# Altium schematic sheet PCB_mini.SchDoc
size A4
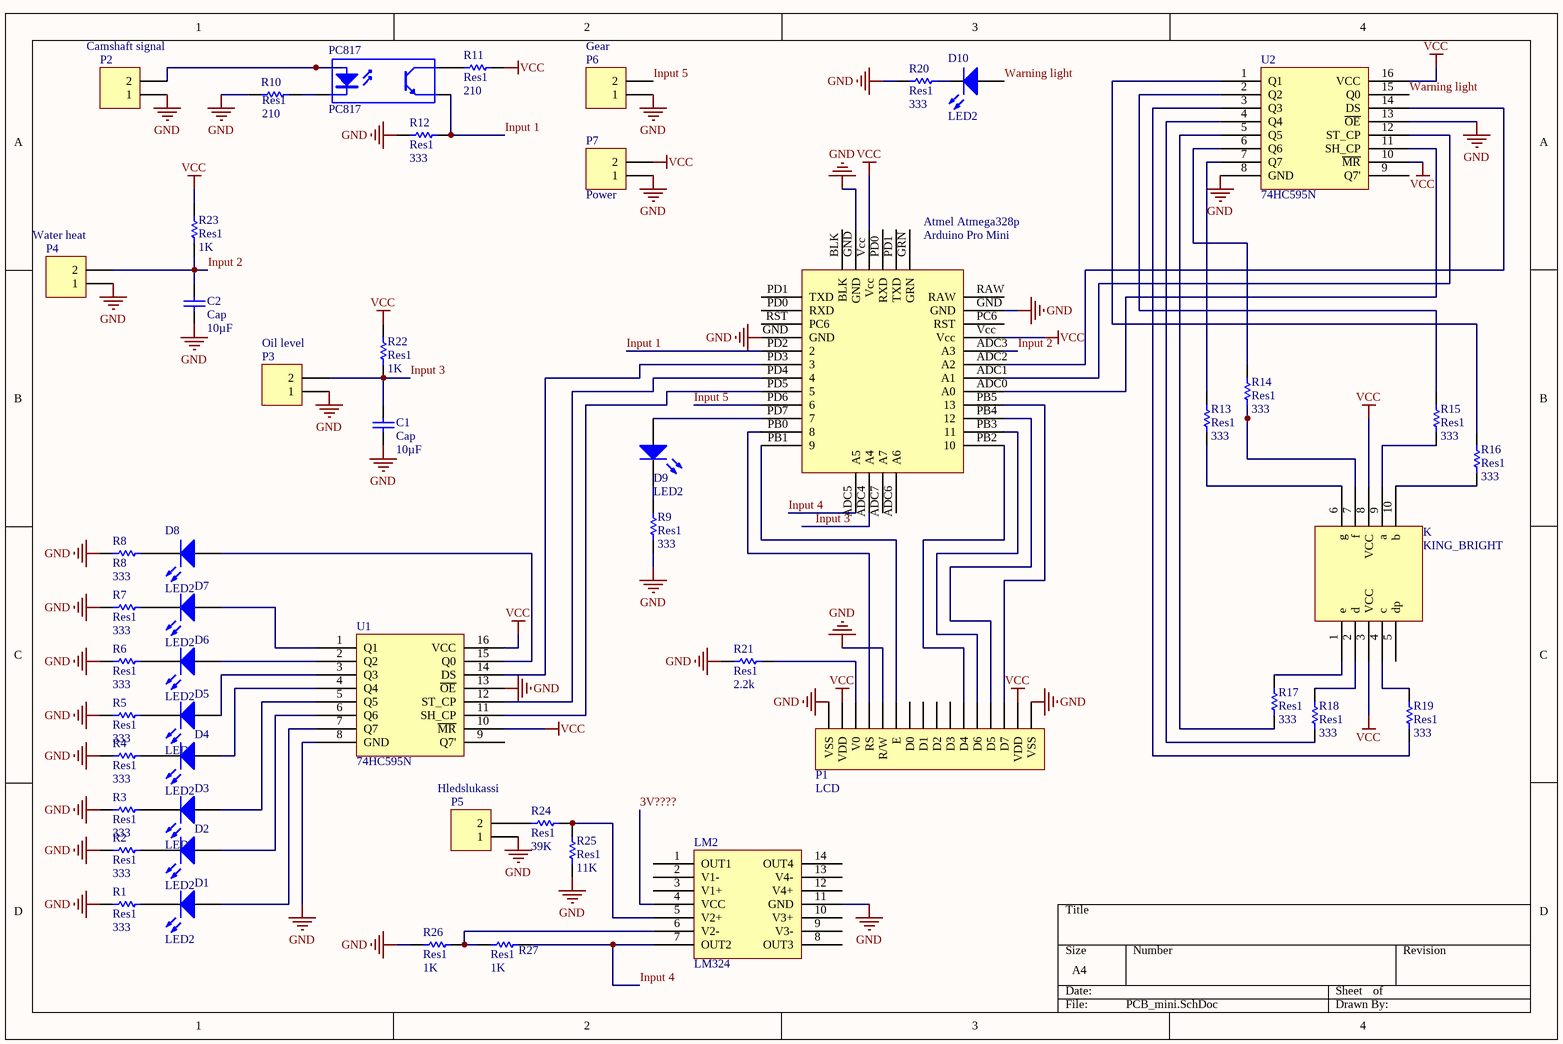
[diagram p0: PCB_mini.SchDoc]

## Parts
Arduino_Pro_Mini  Atmel Atmega328p  [ArduinoProMini]
C1  Cap  value 10µF  [1206 footprint]
C2  Cap  value 10µF  [1206 footprint]
D1  LED2  [3.2X1.6X1.1]
D2  LED2  [3.2X1.6X1.1]
D3  LED2  [3.2X1.6X1.1]
D4  LED2  [3.2X1.6X1.1]
D5  LED2  [3.2X1.6X1.1]
D6  LED2  [3.2X1.6X1.1]
D7  LED2  [3.2X1.6X1.1]
D8  LED2  [3.2X1.6X1.1]
D9  LED2  [3.2X1.6X1.1]
D10  LED2  [3.2X1.6X1.1]
K  KING_BRIGHT  [KNIGHT_BRIGHT]
LM2  LM324  [SOP-14]
P1  LCD  [HDR1X16]
P2  Camshaft signal  [HDR1X2]
P3  Oil level  [HDR1X2]
P4  Water heat  [HDR1X2]
P5  Hledslukassi  [HDR1X2]
P6  Gear  [HDR1X2]
P7  Power  [HDR1X2]
PC817  PC817  [PC817 SMT]
R1  Res1  value 333  [AXIAL-0.3]
R2  Res1  value 333  [AXIAL-0.3]
R3  Res1  value 333  [AXIAL-0.3]
R4  Res1  value 333  [AXIAL-0.3]
R5  Res1  value 333  [AXIAL-0.3]
R6  Res1  value 333  [AXIAL-0.3]
R7  Res1  value 333  [AXIAL-0.3]
R8  R8  value 333  [AXIAL-0.3]
R9  Res1  value 333  [AXIAL-0.3]
R10  Res1  value 210  [AXIAL-0.3]
R11  Res1  value 210  [AXIAL-0.3]
R12  Res1  value 333  [AXIAL-0.3]
R13  Res1  value 333  [AXIAL-0.3]
R14  Res1  value 333  [AXIAL-0.3]
R15  Res1  value 333  [AXIAL-0.3]
R16  Res1  value 333  [AXIAL-0.3]
R17  Res1  value 333  [AXIAL-0.3]
R18  Res1  value 333  [AXIAL-0.3]
R19  Res1  value 333  [AXIAL-0.3]
R20  Res1  value 333  [AXIAL-0.3]
R21  Res1  value 2.2k  [AXIAL-0.3]
R22  Res1  value 1K  [AXIAL-0.3]
R23  Res1  value 1K  [AXIAL-0.3]
R24  Res1  value 39K  [AXIAL-0.3]
R25  Res1  value 11K  [AXIAL-0.3]
R26  Res1  value 1K  [AXIAL-0.3]
R27  Res1  value 1K  [AXIAL-0.3]
U1  74HC595N  [N14A]
U2  74HC595N  [N14A]

## Nets
GND: Arduino_Pro_Mini.GND C1.1 C2.1 LM2.11(GND) P1.1(VSS) P1.5(R/W) P1.16(VSS) P2.1 P3.1 P4.1 P5.1 P6.1 P7.1 R1.2 R2.2 R3.2 R4.2 R5.2 R6.2 R7.2 R8.2 R9.2 R10.1 R12.2 R20.2 R21.1 R25.2 R26.2 U1.8(GND) U1.13(~{OE}) U2.8(GND) U2.13(~{OE})
VCC: Arduino_Pro_Mini.Vcc K.3(VCC) K.8(VCC) P1.2(VDD) P1.15(VDD) P7.2 R11.1 R22.1 R23.1 U1.10(~{MR}) U1.16(VCC) U2.10(~{MR}) U2.16(VCC)
3V????: LM2.4(VCC)
Input 1: Arduino_Pro_Mini.PD2(2) PC817.3(E) R12.1
Input 2: Arduino_Pro_Mini.ADC3(A3) C2.2 P4.2 R23.2
Input 3: Arduino_Pro_Mini.ADC4(A4) C1.2 P3.2 R22.2
Input 4: Arduino_Pro_Mini.ADC5(A5) LM2.7(OUT2) R27.2
Input 5: Arduino_Pro_Mini.PD6(6) P6.2
Warning light: D10.1(A) U2.15(Q0)
NetArduino_Pro_Mini_ADC0: Arduino_Pro_Mini.ADC0(A0) U2.11(SH_CP)
NetArduino_Pro_Mini_ADC1: Arduino_Pro_Mini.ADC1(A1) U2.12(ST_CP)
NetArduino_Pro_Mini_ADC2: Arduino_Pro_Mini.ADC2(A2) U2.14(DS)
NetArduino_Pro_Mini_PB0: Arduino_Pro_Mini.PB0(8) P1.4(RS)
NetArduino_Pro_Mini_PB1: Arduino_Pro_Mini.PB1(9) P1.6(E)
NetArduino_Pro_Mini_PB2: Arduino_Pro_Mini.PB2(10) P1.11(D4)
NetArduino_Pro_Mini_PB3: Arduino_Pro_Mini.PB3(11) P1.13(D6)
NetArduino_Pro_Mini_PB4: Arduino_Pro_Mini.PB4(12) P1.12(D5)
NetArduino_Pro_Mini_PB5: Arduino_Pro_Mini.PB5(13) P1.14(D7)
NetArduino_Pro_Mini_PD3: Arduino_Pro_Mini.PD3(3) U1.14(DS)
NetArduino_Pro_Mini_PD4: Arduino_Pro_Mini.PD4(4) U1.12(ST_CP)
NetArduino_Pro_Mini_PD5: Arduino_Pro_Mini.PD5(5) U1.11(SH_CP)
NetArduino_Pro_Mini_PD7: Arduino_Pro_Mini.PD7(7) D9.1(A)
NetD1_1: D1.1(A) U1.7(Q7)
NetD1_2: D1.2(K) R1.1
NetD2_1: D2.1(A) U1.6(Q6)
NetD2_2: D2.2(K) R2.1
NetD3_1: D3.1(A) U1.5(Q5)
NetD3_2: D3.2(K) R3.1
NetD4_1: D4.1(A) U1.4(Q4)
NetD4_2: D4.2(K) R4.1
NetD5_1: D5.1(A) U1.3(Q3)
NetD5_2: D5.2(K) R5.1
NetD6_1: D6.1(A) U1.2(Q2)
NetD6_2: D6.2(K) R6.1
NetD7_1: D7.1(A) U1.1(Q1)
NetD7_2: D7.2(K) R7.1
NetD8_1: D8.1(A) U1.15(Q0)
NetD8_2: D8.2(K) R8.1
NetD9_2: D9.2(K) R9.1
NetD10_2: D10.2(K) R20.1
NetK_1: K.1(e) R17.1
NetK_2: K.2(d) R18.1
NetK_4: K.4(c) R19.1
NetK_6: K.6(g) R13.2
NetK_7: K.7(f) R14.1
NetK_9: K.9(a) R15.2
NetK_10: K.10(b) R16.2
NetLM2_5: LM2.5(V2+) R24.2 R25.1
NetLM2_6: LM2.6(V2-) R26.1 R27.1
NetP1_3: P1.3(V0) R21.2
NetP2_2: P2.2 PC817.1(A)
NetP5_2: P5.2 R24.1
NetPC817_2: PC817.2(K) R10.2
NetPC817_4: PC817.4(C) R11.2
NetR13_1: R13.1 U2.7(Q7)
NetR14_2: R14.2 U2.6(Q6)
NetR15_1: R15.1 U2.2(Q2)
NetR16_1: R16.1 U2.1(Q1)
NetR17_2: R17.2 U2.5(Q5)
NetR18_2: R18.2 U2.4(Q4)
NetR19_2: R19.2 U2.3(Q3)

Not connected (* = marked no-connect by the designer): Arduino_Pro_Mini ADC6(A6) ADC7(A7) BLK GRN PC6(RST) PD0(RXD) PD1(TXD) RAW RST(PC6); K 5(dp); LM2 1(OUT1) 2(V1-) 3(V1+) 8(OUT3) 9(V3-) 10(V3+) 12(V4+) 13(V4-) 14(OUT4); P1 7(D0) 8(D1) 9(D2) 10(D3); U1 9(Q7'); U2 9(Q7')

## Library data of the parts
Arduino_Pro_Mini = ArduinoProMini
D1-D10 = LED2: Typical RED, GREEN, YELLOW, AMBER GaAs LED; Published: 8-Jun-2000; LatestRevisionDate: 17-Jul-2002; LatestRevisionNote: Re-released for DXP Platform.; PackageVersion: Feb-2002; PackageReference: 3.2X1.6X1.1; Publisher: Altium Limited; PackageDescription: SM LED; 2 Flat Leads
P1 = Header 16: Header, 16-Pin; LatestRevisionDate: 17-Jul-2002; LatestRevisionNote: Re-released for DXP Platform.; Publisher: Altium Limited
P2-P7 = Header 2: Header, 2-Pin; LatestRevisionDate: 17-Jul-2002; LatestRevisionNote: Re-released for DXP Platform.; Publisher: Altium Limited
R1-R27 = Res1: Resistor; Published: 8-Jun-2000; LatestRevisionDate: 17-Jul-2002; LatestRevisionNote: Re-released for DXP Platform.; PackageReference: AXIAL-0.3; Publisher: Altium Limited; PackageDescription: Axial Device, Thru-Hole; 2 Leads; 0.3 in Pin Spacing
U1 U2 = SN74LS06N